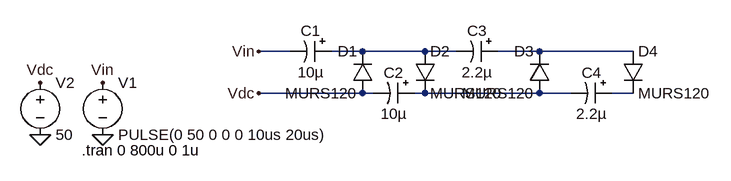
[diagram p0: schematic Doubler.asc]
Doubler.asc, the LTspice schematic file:
Version 4
SHEET 1 924 680
WIRE 272 112 224 112
WIRE 384 112 336 112
WIRE 480 112 384 112
WIRE 528 112 480 112
WIRE 656 112 592 112
WIRE 800 112 656 112
WIRE 384 176 224 176
WIRE 400 176 384 176
WIRE 480 176 464 176
WIRE 656 176 480 176
WIRE 704 176 656 176
WIRE 800 176 768 176
FLAG -16 240 0
FLAG -16 160 Vin
FLAG 224 112 Vin
FLAG -112 240 0
FLAG -112 160 Vdc
FLAG 224 176 Vdc
SYMBOL voltage -16 144 R0
WINDOW 123 0 0 Left 0
WINDOW 39 0 0 Left 0
SYMATTR InstName V1
SYMATTR Value PULSE(0 50 0 0 0 10us 20us)
SYMBOL diode 464 112 R0
SYMATTR InstName D2
SYMATTR Value MURS120
SYMBOL diode 400 176 R180
WINDOW 0 24 64 Left 2
WINDOW 3 24 0 Left 2
SYMATTR InstName D1
SYMATTR Value MURS120
SYMBOL voltage -112 144 R0
WINDOW 123 0 0 Left 0
WINDOW 39 0 0 Left 0
SYMATTR InstName V2
SYMATTR Value 50
SYMBOL polcap 336 96 R90
WINDOW 0 0 32 VBottom 2
WINDOW 3 32 32 VTop 2
SYMATTR InstName C1
SYMATTR Value 10µ
SYMBOL polcap 464 160 R90
WINDOW 0 0 32 VBottom 2
WINDOW 3 32 32 VTop 2
SYMATTR InstName C2
SYMATTR Value 10µ
SYMBOL polcap 592 96 R90
WINDOW 0 0 32 VBottom 2
WINDOW 3 32 32 VTop 2
SYMATTR InstName C3
SYMATTR Value 2.2µ
SYMBOL polcap 768 160 R90
WINDOW 0 0 32 VBottom 2
WINDOW 3 32 32 VTop 2
SYMATTR InstName C4
SYMATTR Value 2.2µ
SYMBOL diode 672 176 R180
WINDOW 0 24 64 Left 2
WINDOW 3 24 0 Left 2
SYMATTR InstName D3
SYMATTR Value MURS120
SYMBOL diode 784 112 R0
SYMATTR InstName D4
SYMATTR Value MURS120
TEXT -48 264 Left 2 !.tran 0 800u 0 1u

The netlist it stands for:
* Doubler.asc
V1 Vin 0 PULSE(0 50 0 0 0 10us 20us)
D2 N001 N003 MURS120
D1 Vdc N001 MURS120
V2 Vdc 0 50
C1 N001 Vin 10µ
C2 N003 Vdc 10µ
C3 N002 N001 2.2µ
C4 N004 N003 2.2µ
D3 N003 N002 MURS120
D4 N002 N004 MURS120
.model D D
.lib standard.dio
.tran 0 800u 0 1u
.backanno
.end